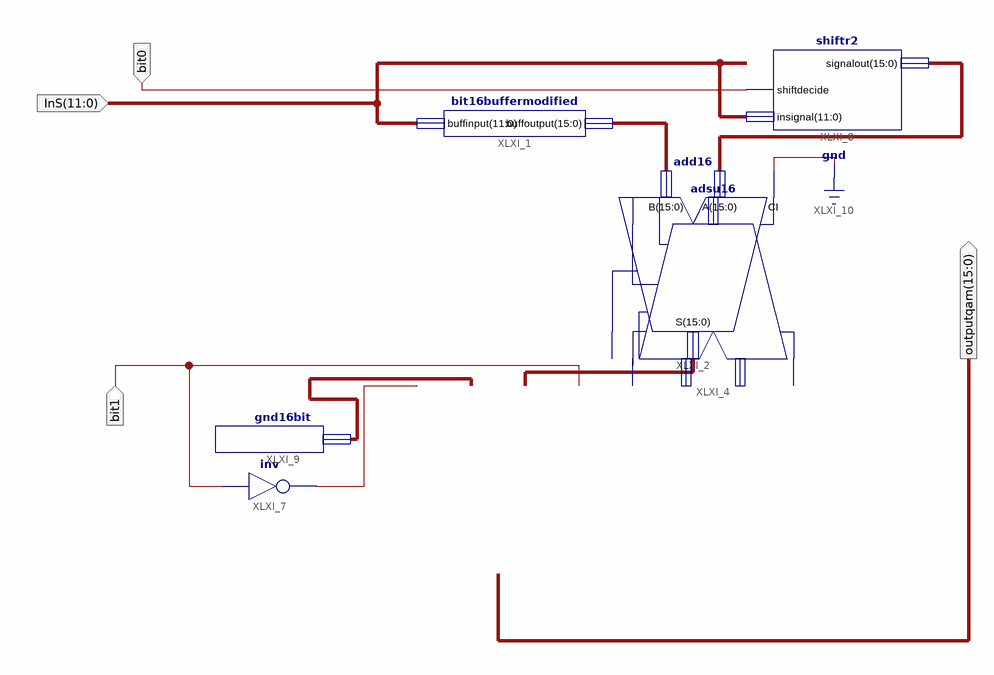
[diagram p0: schematic sheet 1]
// Xilinx ISE schematic addshiftr2.sch (spartan3) as structural Verilog: 6 symbols, 4 ports
module addshiftr2 (
  input  [11:0] InS,
  input  bit1,
  input  bit0,
  output [15:0] outputqam
);

  wire XLXN_10;
  wire [15:0] XLXN_3, XLXN_4, XLXN_6, XLXN_8;

  bit16buffermodified XLXI_1 (.buffinput(InS), .buffoutput(XLXN_3));
  add16 XLXI_2 (.A(XLXN_6), .B(XLXN_3), .CI(1'b0), .S(XLXN_4));  // open: CO, OFL
  adsu16 XLXI_4 (.A(XLXN_8), .ADD(bit1), .B(XLXN_4), .CI(XLXN_10), .S(outputqam));  // open: CO, OFL
  not XLXI_7 (XLXN_10, bit1);
  shiftr2 XLXI_8 (.shiftdecide(bit0), .signalout(XLXN_6), .insignal(InS));
  gnd16bit XLXI_9 (.x_constant(XLXN_8));
endmodule
